# Altium project TMC_CARD.PrjPcb
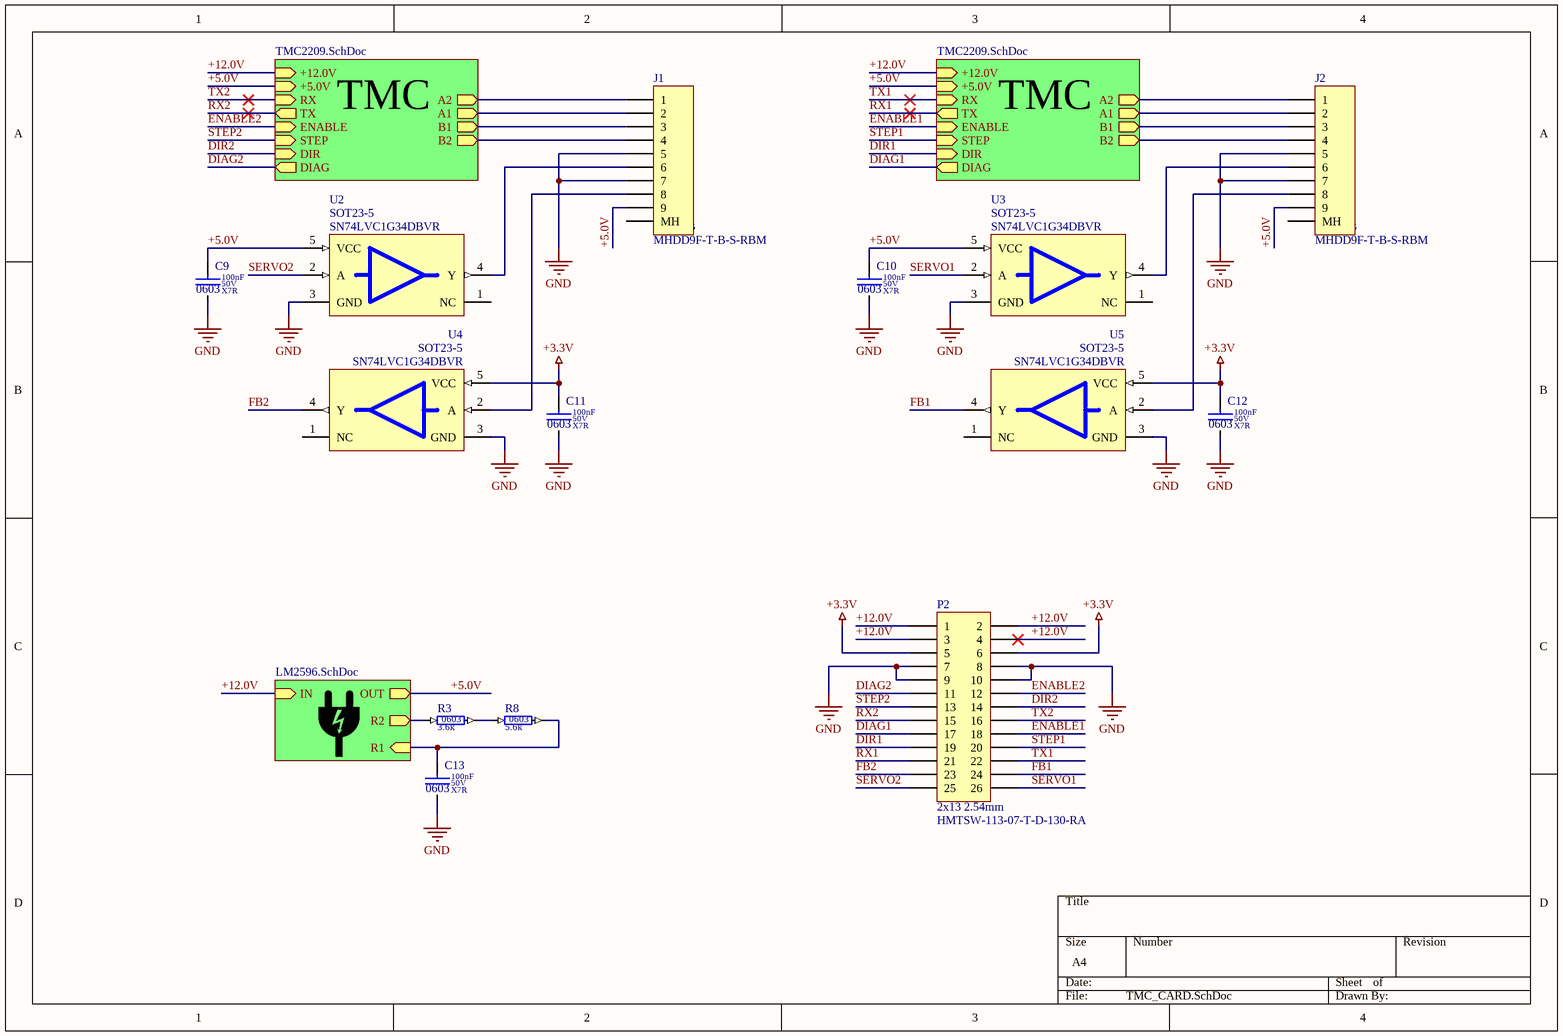
[diagram p0: TMC_CARD.SchDoc]
3 sheets, 56 parts. Net scope: hierarchical (ports join the sheet entries above them; power ports are global).
Board file: TMC_CARD.PcbDoc
Sheets:
  TMC_CARD.SchDoc
    Designator = TMC2209.SchDoc
    Designator = LM2596.SchDoc
    Designator = TMC2209.SchDoc

## Sheet TMC_CARD.SchDoc
size A4

### Parts
C9  value 100nF  Dielectric: X7R  Voltage: 50V  SCH_Footprint: 0603  [C_0603_1608]  (hidden comment: Ceramic X7R)
C10  value 100nF  Dielectric: X7R  Voltage: 50V  SCH_Footprint: 0603  [C_0603_1608]  (hidden comment: Ceramic X7R)
C11  value 100nF  Dielectric: X7R  Voltage: 50V  SCH_Footprint: 0603  [C_0603_1608]  (hidden comment: Ceramic X7R)
C12  value 100nF  Dielectric: X7R  Voltage: 50V  SCH_Footprint: 0603  [C_0603_1608]  (hidden comment: Ceramic X7R)
C13  value 100nF  Dielectric: X7R  Voltage: 50V  SCH_Footprint: 0603  [C_0603_1608]  (hidden comment: Ceramic X7R)
J1  value MHDD9F-T-B-S-RBM  [J_DSUB_MHDD9F-T-B-S-RBM]  (hidden comment: DSUB 9 Pin)
J2  value MHDD9F-T-B-S-RBM  [J_DSUB_MHDD9F-T-B-S-RBM]  (hidden comment: DSUB 9 Pin)
P2  value HMTSW-113-07-T-D-130-RA  SCH_Footprint: 2x13 2.54mm  [P_HEADER_2x13_2.54_RIGHT_ANGLE]  (hidden comment: Goldpin male)
R3  value 3.6k  SCH_Footprint: 0603  [R_0603_1608]  (hidden comment: Resistor)
R8  value 5.6k  SCH_Footprint: 0603  [R_0603_1608]  (hidden comment: Resistor)
U2  value SN74LVC1G34DBVR  SCH_Footprint: SOT23-5  [SOT23-5_SC74A_SOT753_M]  (hidden comment: Single Buffer Gate)
U3  value SN74LVC1G34DBVR  SCH_Footprint: SOT23-5  [SOT23-5_SC74A_SOT753_M]  (hidden comment: Single Buffer Gate)
U4  value SN74LVC1G34DBVR  SCH_Footprint: SOT23-5  [SOT23-5_SC74A_SOT753_M]  (hidden comment: Single Buffer Gate)
U5  value SN74LVC1G34DBVR  SCH_Footprint: SOT23-5  [SOT23-5_SC74A_SOT753_M]  (hidden comment: Single Buffer Gate)

### Sub-sheets
Designator = TMC2209.SchDoc: TX (out), +5.0V (in), RX (in), DIR (in), STEP (in), +12.0V (in), DIAG (out), ENABLE (in), A1 (out), A2 (out), B2 (out), B1 (out)
Designator = LM2596.SchDoc: IN (in), R1 (in), R2 (out), OUT (out)
Designator = TMC2209.SchDoc: TX (out), +5.0V (in), RX (in), DIR (in), STEP (in), +12.0V (in), DIAG (out), ENABLE (in), A1 (out), A2 (out), B2 (out), B1 (out)

### Nets
+3.3V: C11.1 C12.1 P2.5 P2.6 U4.5(VCC) U5.5(VCC)
GND: C9.2 C10.2 C11.2 C12.2 C13.2 J1.5 J1.7 J2.5 J2.7 P2.7 P2.8 P2.9 P2.10 U2.3(GND) U3.3(GND) U4.3(GND) U5.3(GND)
+5.0V: C9.1 C10.1 J1.9 J2.9 R3.1 U2.5(VCC) U3.5(VCC) ; sheet Designator/+5.0V, sheet Designator/R2, sheet Designator/OUT, sheet Designator/+5.0V
+12.0V: P2.1 P2.2 P2.3 P2.4 ; sheet Designator/+12.0V, sheet Designator/IN, sheet Designator/+12.0V
DIAG1: P2.17 ; sheet Designator/DIAG  [project net DIAG]
DIAG2: P2.11 ; sheet Designator/DIAG  [project net DIAG]
DIR1: P2.19 ; sheet Designator/DIR  [project net DIR]
DIR2: P2.14 ; sheet Designator/DIR  [project net DIR]
ENABLE1: P2.18 ; sheet Designator/ENABLE  [project net ENABLE]
ENABLE2: P2.12 ; sheet Designator/ENABLE  [project net ENABLE]
FB1: P2.24 U5.4(Y)
FB2: P2.23 U4.4(Y)
RX1: P2.21 ; sheet Designator/TX
RX2: P2.15 ; sheet Designator/TX
SERVO1: P2.26 U3.2(A)
SERVO2: P2.25 U2.2(A)
STEP1: P2.20 ; sheet Designator/STEP  [project net STEP]
STEP2: P2.13 ; sheet Designator/STEP  [project net STEP]
TX1: P2.22 ; sheet Designator/RX
TX2: P2.16 ; sheet Designator/RX
NetC13_1: C13.1 R8.2 ; sheet Designator/R1
NetC23_Designator#1_2: J1.2 ; sheet Designator/A1
NetC23_Designator#2_2: J2.2 ; sheet Designator/A1
NetC32_Designator#1_2: J1.1 ; sheet Designator/A2
NetC32_Designator#2_2: J2.1 ; sheet Designator/A2
NetC33_Designator#1_1: J1.3 ; sheet Designator/B1
NetC33_Designator#2_1: J2.3 ; sheet Designator/B1
NetC34_Designator#1_1: J1.4 ; sheet Designator/B2
NetC34_Designator#2_1: J2.4 ; sheet Designator/B2
NetJ1_6: J1.6 U2.4(Y)
NetJ1_8: J1.8 U4.2(A)
NetJ2_6: J2.6 U3.4(Y)
NetJ2_8: J2.8 U5.2(A)
NetR3_2: R3.2 R8.1

Not connected (* = marked no-connect by the designer): J1 MH; J2 MH; U2 1(NC); U3 1(NC); U4 1(NC); U5 1(NC)

### Notes on the sheet
- TMC

### Library data of the parts
C9-C13 = C_100nF_50V_X7R_0603_5: Capacitor; Manufacturer: Samsung; Manufacturer Part Number: CL10B104JB8NNNC; Tolerance (%): 5; Part Number: C_100nF_50V_X7R_0603_5; HelpURL: http://www.tme.eu/pl/Document/4a42202b32dab16128fe107dd69598cc/samsung-chip-cap.pdf; Supplier 1: TME; Supplier Part Number 1: CL10B104JB8NNNC; Supplier 2: RS Components; Supplier Part Number 2: 7665455; Supplier 3: Farnell; Supplier 4: Mouser; Supplier 5: Digi-Key; Supplier Part Number 5: 1276-1033-1-ND; Supplier 6: LCSC; Supplier Part Number 6: C24452
J1 J2 = J_DSUB: Header, 9-Pin; Manufacturer: MH Connectors; SCH_Footprint: J_DSUB; Part Number: J_DSUB; HelpURL: https://www.tme.eu/Document/d24efe21bdaa08410b5ca50a678e1de1/MHDDXX-F-T-B-S-RBM.PDF; Manufacturer Part Number: MHDD9F-T-B-S-RBM; Supplier 1: TME; Supplier Part Number 1: MHDD9F-T-B-S-RBM; Supplier 2: RS Components; Supplier 3: Farnell; Supplier Part Number 3: 2533067; Supplier 4: Mouser; Supplier 5: Digi-Key; Supplier 6: LCSC
P2 = P_HEADER_2x13_2.54_ANGLE: Pin Header; Manufacturer: Samtec; Part Number: P_HEADER_2x13_2.54_ANGLE; HelpURL: https://datasheet.octopart.com/HMTSW-113-07-T-D-130-RA-Samtec-datasheet-97080704.pdf; Manufacturer Part Number: HMTSW-113-07-T-D-130-RA; Supplier 1: TME; Supplier 2: RS Components; Supplier 3: Farnell; Supplier 4: Mouser; Supplier Part Number 4: 200-HMTSW1137TD130RA; Supplier 5: Digi-Key; Supplier Part Number 5: HMTSW-113-07-T-D-130-RA-ND; Supplier 6: LCSC
R3 = R_3.6k_0603_1: Manufacturer: Royalohm; Manufacturer Part Number: 0603SAF3601T5E; Voltage: 50V; Power: 100mW; Tolerance: 1%; Part Number: R_3.6k_0603_1; HelpURL: http://www.tme.eu/pl/Document/9e42ba54d36a9bd3dfa2901986ac022d/rezystor-smd.pdf; Supplier 1: TME; Supplier Part Number 1: SMD0603-3K6-1%; Supplier 2: RS Components; Supplier 3: Farnell; Supplier 4: Mouser; Supplier 5: Digi-Key; Supplier 6: LCSC
R8 = R_5.6k_0603_1: Manufacturer: Panasonic; Manufacturer Part Number: ERJ-P03F5601V; Voltage: 150V; Power: 200mW; Tolerance: 1%; Part Number: R_5.6k_0603_1; HelpURL: http://www.farnell.com/datasheets/2254497.pdf?_ga=2.43877285.1484910855.1540115356-953128292.1508669538&_gac=1.120258938.1537431950.CjwKCAjwio3dBRAqEiwAHWsNVZEMh9W8beiEu-RVCZge823z2VsFxW0tiik5tVH4kBGBJX-1pEyq7RoCMTgQAvD_BwE; Supplier 1: TME; Supplier 2: RS Components; Supplier Part Number 2: 721-7400; Supplier 3: Farnell; Supplier Part Number 3: 1750682; Supplier 4: Mouser; Supplier Part Number 4: 667-ERJ-P03F5601V; Supplier 5: Digi-Key; Supplier Part Number 5: ERJ-P03F5601V-ND; Supplier 6: LCSC
U2-U5 = U_SN74LVC1G34DBVR: Manufacturer: Texas Instruments; Part Number: U_SN74LVC1G34DBVR; HelpURL: http://www.ti.com/lit/ds/symlink/sn74lvc1g34.pdf; Manufacturer Part Number: SN74LVC1G34DBVR; Supplier 1: TME; Supplier Part Number 1: SN74LVC1G34DBVR; Supplier 2: RS Components; Supplier Part Number 2: 662-8774; Supplier 3: Farnell; Supplier Part Number 3: 2134094; Supplier 4: Mouser; Supplier Part Number 4: 595-SN74LVC1G34DBVR; Supplier 5: Digi-Key; Supplier Part Number 5: 296-17893-1-ND; Supplier 6: LCSC

## Sheet TMC2209.SchDoc
size A4
Used 2 times, as channels Designator, Designator. Parts and nets are listed once, with the designators drawn on the sheet.
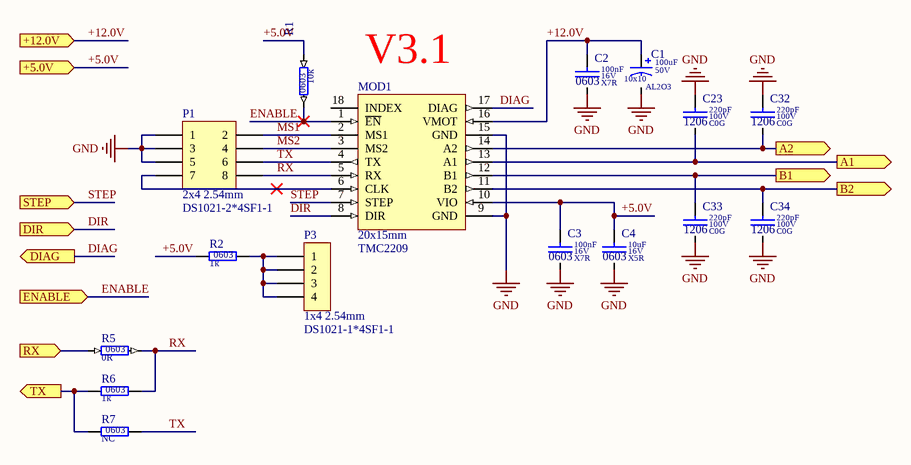
[diagram p1: TMC2209.SchDoc]

### Parts
C1  value 100uF  Dielectric: AL2O3  SCH_Footprint: 10x10  Voltage: 50V  [CE_D_10x10MM]  (hidden comment: Electrolytic Capacitor)
C2  value 100nF  Dielectric: X7R  Voltage: 16V  SCH_Footprint: 0603  [C_0603_1608]  (hidden comment: Ceramic X7R)
C3  value 100nF  Dielectric: X7R  Voltage: 16V  SCH_Footprint: 0603  [C_0603_1608]  (hidden comment: Ceramic X7R)
C4  value 10uF  Dielectric: X5R  Voltage: 16V  SCH_Footprint: 0603  [C_0603_1608]  (hidden comment: Ceramic X5R)
C23  value 220pF  Dielectric: C0G  Voltage: 100V  SCH_Footprint: 1206  [C_1206_3216]  (hidden comment: Ceramic C0G)
C32  value 220pF  Dielectric: C0G  Voltage: 100V  SCH_Footprint: 1206  [C_1206_3216]  (hidden comment: Ceramic C0G)
C33  value 220pF  Dielectric: C0G  Voltage: 100V  SCH_Footprint: 1206  [C_1206_3216]  (hidden comment: Ceramic C0G)
C34  value 220pF  Dielectric: C0G  Voltage: 100V  SCH_Footprint: 1206  [C_1206_3216]  (hidden comment: Ceramic C0G)
MOD1  value TMC2209  SCH_Footprint: 20x15mm  [MOD_TMC2209]  (hidden comment: The TMC2209 is an ultra-silent motor driver IC for two phase stepper motors.)
P1  value DS1021-2*4SF1-1  SCH_Footprint: 2x4 2.54mm  [P_HEADER_2x4_2.54]  (hidden comment: Goldpin male)
P3  value DS1021-1*4SF1-1  SCH_Footprint: 1x4 2.54mm  [P_HEADER_1x4_2.54]  (hidden comment: Goldpin)
R1  value 10k  SCH_Footprint: 0603  [R_0603_1608]  (hidden comment: Resistor)
R2  value 1k  SCH_Footprint: 0603  [R_0603_1608]  (hidden comment: Resistor)
R5  value 0R  SCH_Footprint: 0603  [R_0603_1608]  (hidden comment: Resistor)
R6  value 1k  SCH_Footprint: 0603  [R_0603_1608]  (hidden comment: Resistor)
R7  value NC  SCH_Footprint: 0603  [R_NC_0603_1608]  (hidden comment: Resistor)

### Ports
+5.0V (in), +12.0V (in), A1 (out), A2 (out), B1 (out), B2 (out), DIAG (out), DIR (in), ENABLE (in), RX (in), STEP (in), TX (out)

### Nets
GND: C1.2 C2.2 C3.2 C4.2 C23.1 C32.1 C33.2 C34.2 MOD1.9(GND) MOD1.15(GND) P1.1 P1.3 P1.5
+5.0V: C3.1 C4.1 MOD1.10(VIO) R1.1 R2.1 ; port +5.0V
+12.0V: C1.1 C2.1 MOD1.16(VMOT) ; port +12.0V
A1: C23.2 MOD1.13(A1) ; port A1
A2: C32.2 MOD1.14(A2) ; port A2
B1: C33.1 MOD1.12(B1) ; port B1
B2: C34.1 MOD1.11(B2) ; port B2
DIAG: MOD1.17(DIAG) ; port DIAG
DIR: MOD1.8(DIR) ; port DIR
ENABLE: MOD1.1(~{EN}) R1.2 ; port ENABLE
MS1: MOD1.2(MS1) P1.2
MS2: MOD1.3(MS2) P1.4
RX: MOD1.5(RX) P1.8 R5.2 R6.2
RX: R5.1 ; port RX  [a separate net that carries the same name]
STEP: MOD1.7(STEP) ; port STEP
TX: MOD1.4(TX) P1.6 R7.2
TX: R6.1 R7.1 ; port TX  [a separate net that carries the same name]
NetMOD1_6: MOD1.6(CLK) P1.7
NetP3_1: P3.1 P3.2 P3.3 P3.4 R2.2

Not connected (* = marked no-connect by the designer): MOD1 18(INDEX)

### Channels
Designator: designators end in _Designator#1; ports +5.0V=+5.0V +12.0V=+12.0V A1=NetC23_Designator#1_2 A2=NetC32_Designator#1_2 B1=NetC33_Designator#1_1 B2=NetC34_Designator#1_1 DIAG=DIAG DIR=DIR ENABLE=ENABLE RX=TX2 STEP=STEP TX=RX2
Designator: designators end in _Designator#2; ports +5.0V=+5.0V +12.0V=+12.0V A1=NetC23_Designator#2_2 A2=NetC32_Designator#2_2 B1=NetC33_Designator#2_1 B2=NetC34_Designator#2_1 DIAG=DIAG DIR=DIR ENABLE=ENABLE RX=TX1 STEP=STEP TX=RX1

### Notes on the sheet
- (near MOD1) V3.1

### Library data of the parts
C1 = CE_100uF_50V_AL2O3_10x10_20: Polarized Capacitor; Manufacturer: Nichicon; Manufacturer Part Number: UUX1H101MNL1GS; Tolerance (%): 20; Part Number: CE_100uF_50V_AL2O3_10x10_20; HelpURL: https://datasheet.octopart.com/UUX1H101MNL1GS-Nichicon-datasheet-62047998.pdf; Supplier 1: TME; Supplier Part Number 1: UUX1H101MNL1GS; Supplier 2: RS Components; Supplier Part Number 2: 739-3107; Supplier 3: Farnell; Supplier Part Number 3: 2841943; Supplier 4: Mouser; Supplier Part Number 4: 647-UUX1H101MNL1GS; Supplier 5: Digi-Key; Supplier Part Number 5: 493-6269-1-ND; Supplier 6: LCSC
C2 C3 = C_100nF_16V_X7R_0603_10: Capacitor; Manufacturer: Kemet; Manufacturer Part Number: C0603C104K4RAC7013; Tolerance (%): 10; Part Number: C_100nF_16V_X7R_0603_10; HelpURL: https://pl.mouser.com/datasheet/2/212/KEM_C1002_X7R_SMD-1102033.pdf; Supplier 1: TME; Supplier 2: RS Components; Supplier 3: Farnell; Supplier 4: Mouser; Supplier Part Number 4: 80-C0603C104K4RC7013; Supplier 5: Digi-Key; Supplier Part Number 5: 399-7372-2-ND; Supplier 6: LCSC
C4 = C_10uF_16V_X5R_0603_20: Capacitor; Manufacturer: Samsung Electro-Mechanics; Manufacturer Part Number: CL10A106MO8NQNC; Tolerance (%): 20; Part Number: C_10uF_16V_X5R_0603_20; HelpURL: http://www.tme.eu/pl/Document/4a42202b32dab16128fe107dd69598cc/samsung-chip-cap.pdf; Supplier 1: TME; Supplier Part Number 1: CL10A106MO8NQNC; Supplier 2: RS Components; Supplier 3: Farnell; Supplier 4: Mouser; Supplier 5: Digi-Key; Supplier 6: LCSC
C23 C32-C34 = C_220pF_100V_C0G_1206_5: Capacitor; Manufacturer: AVX; Manufacturer Part Number: 12061A221JAT2A; Tolerance (%): 5; Part Number: C_220pF_100V_C0G_1206_5; HelpURL: https://datasheet.octopart.com/12061A221JAT2A-AVX-datasheet-9883399.pdf; Supplier 1: TME; Supplier Part Number 1: 12061A221JAT2A; Supplier 2: RS Components; Supplier Part Number 2: 1364313; Supplier 3: Farnell; Supplier Part Number 3: 499286; Supplier 4: Mouser; Supplier Part Number 4: 581-12061A221J; Supplier 5: Digi-Key; Supplier Part Number 5: 478-1446-1-ND; Supplier 6: LCSC
MOD1 = MOD_TMC2209: Manufacturer: Trinamic; Part Number: MOD_TMC2209; HelpURL: https://www.trinamic.com/fileadmin/assets/Products/ICs_Documents/TMC2209_Datasheet_V103.pdf; Manufacturer Part Number: TMC2209; Supplier 1: TME; Supplier 2: RS Components; Supplier 3: Farnell; Supplier Part Number 3: 3131532; Supplier 4: Mouser; Supplier Part Number 4: 700-TMC2209SILENTSTE; Supplier 5: Digi-Key; Supplier Part Number 5: 1460-1395-ND; Supplier 6: LCSC
P1 = P_HEADER_2x4_2.54: Pin Header; Manufacturer: Connfly; Part Number: P_HEADER_2x4_2.54; HelpURL: https://www.tme.eu/Document/cc301e58a5da78cb543a94b5a5b7f06a/DS1021.pdf; Manufacturer Part Number: DS1021-2*4SF1-1; Supplier 1: TME; Supplier Part Number 1: ZL202-8G; Supplier 2: RS Components; Supplier 3: Farnell; Supplier 4: Mouser; Supplier 5: Digi-Key; Supplier 6: LCSC
P3 = P_HEADER_1x4_2.54: Pin Header; Manufacturer: Connfly; Part Number: P_HEADER_1x4_2.54; HelpURL: http://datasheet.octopart.com/DS1021-1%2A4SF1-1-Connfly-datasheet-65537859.pdf; Manufacturer Part Number: DS1021-1*4SF1-1; Supplier 1: TME; Supplier Part Number 1: ZL201-04G; Supplier 2: RS Components; Supplier 3: Farnell; Supplier 4: Mouser; Supplier 5: Digi-Key; Supplier 6: LCSC
R1 = R_10k_0603_1: Manufacturer: Vishay; Manufacturer Part Number: CRCW060310K0FKTABC; Voltage: 75V; Power: 100mW; Tolerance: 1%; Part Number: R_10k_0603_1; HelpURL: http://www.tme.eu/pl/Document/622e28308c06d160637f2b14751ba16b/Data%20Sheet%20CRCW_BCe3.pdf; Supplier 1: TME; Supplier Part Number 1: CRCW060310K0FKTABC; Supplier 2: RS Components; Supplier 3: Farnell; Supplier 4: Mouser; Supplier Part Number 4: 667-ERJ-3EKF1002V; Supplier 5: Digi-Key; Supplier Part Number 5: P10KGCT-ND
R2 R6 = R_1k_0603_1: Manufacturer: Vishay; Manufacturer Part Number: CRCW06031K00FKEA; Voltage: 75V; Power: 100mW; Tolerance: 1%; Part Number: R_1k_0603_1; HelpURL: http://www.farnell.com/datasheets/2310790.pdf?_ga=2.256888843.1690599162.1548417389-1379097396.1542296996&_gac=1.262631934.1547230258.Cj0KCQiAmuHhBRD0ARIsAFWyPwhX8HcvXnM3tA0ZBodZLzDIjH2ZxLpjT5LWo9bad_HPRbU8LfPq44UaAhEwEALw_wcB; Supplier 1: TME; Supplier 2: RS Components; Supplier Part Number 2: 678-9875P; Supplier 3: Farnell; Supplier Part Number 3: 1469740; Supplier 4: Mouser; Supplier Part Number 4: 71-CRCW0603-1.0K-E3; Supplier 5: Digi-Key; Supplier Part Number 5: 541-1.00KHCT-ND; Supplier 6: LCSC
R5 = R_0R_0603_1: Manufacturer: Yageo; Manufacturer Part Number: RC0603FR-070RL; Voltage: 75V; Power: 100mW; Tolerance: 1%; Part Number: R_0R_0603_1; HelpURL: https://datasheet.octopart.com/RC0603FR-070RL-Yageo-datasheet-8328172.pdf; Supplier 1: TME; Supplier Part Number 1: RC0603FR-070RL; Supplier 2: RS Components; Supplier 3: Farnell; Supplier Part Number 3: 2309106; Supplier 4: Mouser; Supplier Part Number 4: 603-RC0603FR-070RL; Supplier 5: Digi-Key; Supplier Part Number 5: 311-0.0HRCT-ND; Supplier 6: LCSC; Supplier Part Number 6: C100044
R7 = R_GENERIC_0603: Part Number: R_GENERIC_0603; Supplier 1: TME; Supplier 2: RS Components; Supplier 3: Farnell; Supplier 4: Mouser; Supplier 5: Digi-Key; Supplier 6: LCSC

## Sheet LM2596.SchDoc
size A4
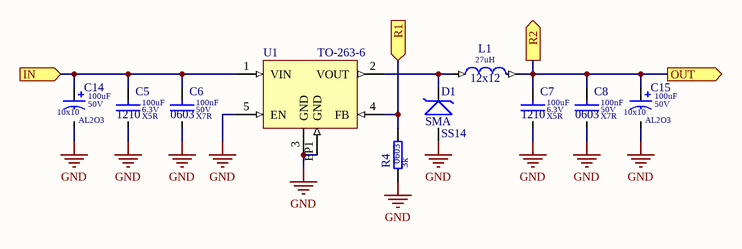
[diagram p2: LM2596.SchDoc]

### Parts
C5  value 100uF  Dielectric: X5R  Voltage: 6.3V  SCH_Footprint: 1210  [C_1210_3225]  (hidden comment: Ceramic X5R)
C6  value 100nF  Dielectric: X7R  Voltage: 50V  SCH_Footprint: 0603  [C_0603_1608]  (hidden comment: Ceramic X7R)
C7  value 100uF  Dielectric: X5R  Voltage: 6.3V  SCH_Footprint: 1210  [C_1210_3225]  (hidden comment: Ceramic X5R)
C8  value 100nF  Dielectric: X7R  Voltage: 50V  SCH_Footprint: 0603  [C_0603_1608]  (hidden comment: Ceramic X7R)
C14  value 100uF  Dielectric: AL2O3  SCH_Footprint: 10x10  Voltage: 50V  [CE_D_10x10MM]  (hidden comment: Electrolytic Capacitor)
C15  value 100uF  Dielectric: AL2O3  SCH_Footprint: 10x10  Voltage: 50V  [CE_D_10x10MM]  (hidden comment: Electrolytic Capacitor)
D1  SCH_Footprint: SMA  [SMA_DO-214AC]  (hidden comment: SS14)
L1  value 27uH  SCH_Footprint: 12x12  [L_SRR1280-XXXY]  (hidden comment: Inductor)
R4  value 3k  SCH_Footprint: 0603  [R_NC_0603_1608]  (hidden comment: Resistor)
U1  VR_LM2596  [TO-263-6]  (value not drawn)

### Ports
IN (in), OUT (out), R1 (in), R2 (out)

### Nets
GND: C5.2 C6.2 C7.2 C8.2 C14.2 C15.2 D1.2 R4.1 U1.3(GND) U1.5(EN) U1.EP1(GND)
+5.0V: C7.1 C8.1 C15.1 L1.2 ; port R2, port OUT
+12.0V: C5.1 C6.1 C14.1 U1.1(VIN) ; port IN
NetC13_1: R4.2 U1.4(FB) ; port R1
NetD1_1: D1.1 L1.1 U1.2(VOUT)

### Library data of the parts
C5 C7 = C_100uF_6.3V_X5R_1210_20: Capacitor; Manufacturer: TDK; Manufacturer Part Number: C3225X5R0J107M250AC; Tolerance (%): 20; Part Number: C_100uF_6.3V_X5R_1210_20; HelpURL: https://datasheet.octopart.com/C3225X5R0J107M250AC-TDK-datasheet-41194876.pdf; Supplier 1: TME; Supplier 2: RS Components; Supplier Part Number 2: 7407685P; Supplier 3: Farnell; Supplier Part Number 3: 2522162; Supplier 4: Mouser; Supplier Part Number 4: 810-C3225X5R0J107M; Supplier 5: Digi-Key; Supplier Part Number 5: 445-1437-1-ND
C6 C8 = C_100nF_50V_X7R_0603_5: as C9 on sheet TMC_CARD; Part Number: C_100nF_50V_X7R_0603_5; HelpURL: http://www.tme.eu/pl/Document/4a42202b32dab16128fe107dd69598cc/samsung-chip-cap.pdf; Supplier 1: TME; Supplier Part Number 1: CL10B104JB8NNNC; Supplier 2: RS Components; Supplier 3: Farnell; Supplier 4: Mouser; Supplier 5: Digi-Key
C14 C15 = CE_100uF_50V_AL2O3_10x10_20: as C1 on sheet TMC2209; Part Number: CE_100uF_50V_AL2O3_10x10_20; HelpURL: https://datasheet.octopart.com/UUX1H101MNL1GS-Nichicon-datasheet-62047998.pdf; Supplier 1: TME; Supplier Part Number 1: UUX1H101MNL1GS; Supplier 2: RS Components; Supplier Part Number 2: 739-3107; Supplier 3: Farnell; Supplier Part Number 3: 2841943; Supplier 4: Mouser; Supplier Part Number 4: 647-UUX1H101MNL1GS; Supplier 5: Digi-Key; Supplier Part Number 5: 493-6269-1-ND; Supplier 6: LCSC
D1 = DS_SS14_1A_40V_SMA: Manufacturer: Fairchild Semiconductor; Voltage: 40V; Current: 1A; Value: SS14; Part Number: DS_SS14_1A_40V_SMA; HelpURL: https://www.vishay.com/docs/88746/ss12.pdf; Manufacturer Part Number: SS14; Supplier 1: TME; Supplier 2: RS Components; Supplier 3: Farnell; Supplier 4: Mouser; Supplier Part Number 4: 512-SS14; Supplier 5: Digi-Key; Supplier Part Number 5: SS14CT
L1 = L_27uH_3.9A_SRR1280: Induction; Manufacturer: Bourns; Manufacturer Part Number: SRR1280-270M; Current: 3.9A; Resistance: 52mR; Part Number: L_27uH_3.9A_SRR1280; HelpURL: https://www.bourns.com/pdfs/SRR1280.pdf; Supplier 1: TME; Supplier 2: RS Components; Supplier Part Number 2: 8749766P; Supplier 3: Farnell; Supplier Part Number 3: 2333859; Supplier 4: Mouser; Supplier Part Number 4: 652-SRR1280-270M; Supplier 5: Digi-Key
R4 = R_GENERIC_0603: Part Number: R_GENERIC_0603; Supplier 1: TME; Supplier 2: RS Components; Supplier 3: Farnell; Supplier 4: Mouser; Supplier 5: Digi-Key
U1 = VR_LM2596-ADJ: SCH_Footprint: TO-263-6; Part Number: VR_LM2596-ADJ; Supplier 1: TME; Supplier 2: RS Components; Supplier 3: Farnell; Supplier 4: Mouser; Supplier 5: Digi-Key

## Nets that join several sheets
GND: TMC_CARD (17 pins), Designator (13 pins), LM2596 (11 pins), Designator (13 pins)
+5.0V: TMC_CARD (7 pins), Designator (5 pins), LM2596 (C7.1 C8.1 C15.1 L1.2), Designator (5 pins)
+12.0V: TMC_CARD (P2.1 P2.2 P2.3 P2.4), Designator (C1_Designator#1.1 C2_Designator#1.1 MOD1_Designator#1.16), LM2596 (C5.1 C6.1 C14.1 U1.1), Designator (C1_Designator#2.1 C2_Designator#2.1 MOD1_Designator#2.16)
DIAG: TMC_CARD (P2.11), Designator (MOD1_Designator#1.17)
DIAG: TMC_CARD (P2.17), Designator (MOD1_Designator#2.17)
DIR: TMC_CARD (P2.14), Designator (MOD1_Designator#1.8)
DIR: TMC_CARD (P2.19), Designator (MOD1_Designator#2.8)
ENABLE: TMC_CARD (P2.12), Designator (MOD1_Designator#1.1 R1_Designator#1.2)
ENABLE: TMC_CARD (P2.18), Designator (MOD1_Designator#2.1 R1_Designator#2.2)
NetC13_1: TMC_CARD (C13.1 R8.2), LM2596 (R4.2 U1.4)
NetC23_Designator#1_2: TMC_CARD (J1.2), Designator (C23_Designator#1.2 MOD1_Designator#1.13)
NetC23_Designator#2_2: TMC_CARD (J2.2), Designator (C23_Designator#2.2 MOD1_Designator#2.13)
NetC32_Designator#1_2: TMC_CARD (J1.1), Designator (C32_Designator#1.2 MOD1_Designator#1.14)
NetC32_Designator#2_2: TMC_CARD (J2.1), Designator (C32_Designator#2.2 MOD1_Designator#2.14)
NetC33_Designator#1_1: TMC_CARD (J1.3), Designator (C33_Designator#1.1 MOD1_Designator#1.12)
NetC33_Designator#2_1: TMC_CARD (J2.3), Designator (C33_Designator#2.1 MOD1_Designator#2.12)
NetC34_Designator#1_1: TMC_CARD (J1.4), Designator (C34_Designator#1.1 MOD1_Designator#1.11)
NetC34_Designator#2_1: TMC_CARD (J2.4), Designator (C34_Designator#2.1 MOD1_Designator#2.11)
RX1: TMC_CARD (P2.21), Designator (R6_Designator#2.1 R7_Designator#2.1)
RX2: TMC_CARD (P2.15), Designator (R6_Designator#1.1 R7_Designator#1.1)
STEP: TMC_CARD (P2.13), Designator (MOD1_Designator#1.7)
STEP: TMC_CARD (P2.20), Designator (MOD1_Designator#2.7)
TX1: TMC_CARD (P2.22), Designator (R5_Designator#2.1)
TX2: TMC_CARD (P2.16), Designator (R5_Designator#1.1)